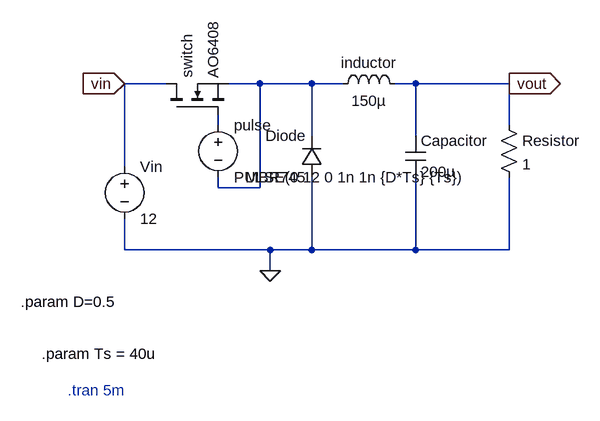
[diagram p0: schematic buck_converter.asc]
buck_converter.asc, the LTspice schematic file:
Version 4.1
SHEET 1 880 680
WIRE 176 -32 112 -32
WIRE 320 -32 272 -32
WIRE 400 -32 320 -32
WIRE 448 -32 400 -32
WIRE 560 -32 528 -32
WIRE 704 -32 560 -32
WIRE 256 32 256 16
WIRE 704 32 704 -32
WIRE 400 48 400 -32
WIRE 560 48 560 -32
WIRE 112 96 112 -32
WIRE 256 128 256 112
WIRE 320 128 320 -32
WIRE 320 128 256 128
WIRE 112 224 112 176
WIRE 336 224 112 224
WIRE 400 224 400 112
WIRE 400 224 336 224
WIRE 560 224 560 112
WIRE 560 224 400 224
WIRE 704 224 704 112
WIRE 704 224 560 224
WIRE 336 256 336 224
FLAG 336 256 0
FLAG 112 -32 vin
IOPIN 112 -32 In
FLAG 704 -32 vout
IOPIN 704 -32 Out
SYMBOL voltage 112 80 R0
WINDOW 123 0 0 Left 0
WINDOW 39 0 0 Left 0
SYMATTR InstName Vin
SYMATTR Value 12
SYMBOL nmos 176 16 R270
SYMATTR InstName switch
SYMATTR Value AO6408
SYMBOL cap 544 48 R0
SYMATTR InstName Capacitor
SYMATTR Value 200µ
SYMATTR SpiceLine Rser=1m
SYMBOL res 688 16 R0
SYMATTR InstName Resistor
SYMATTR Value 1
SYMBOL voltage 256 16 R0
WINDOW 123 0 0 Left 0
WINDOW 39 0 0 Left 0
SYMATTR InstName pulse
SYMATTR Value PULSE(0 12 0 1n 1n {D*Ts} {Ts})
SYMBOL diode 416 112 R180
WINDOW 0 24 64 Left 2
WINDOW 3 24 0 Left 2
SYMATTR InstName Diode
SYMATTR Value MBR745
SYMBOL ind 432 -16 R270
WINDOW 0 32 56 VTop 2
WINDOW 3 5 56 VBottom 2
SYMATTR InstName inductor
SYMATTR Value 150µ
SYMATTR SpiceLine Rser=20m
TEXT -48 304 Left 2 !.param D=0.5
TEXT -16 384 Left 2 !.param Ts = 40u
TEXT 24 440 Left 2 ;.tran 5m

The netlist it stands for:
* buck_converter.asc
Vin vin 0 12
M§switch vin N002 N001 N001 AO6408
Capacitor vout 0 200µ Rser=1m
Resistor vout 0 1
V§pulse N002 N001 PULSE(0 12 0 1n 1n {D*Ts} {Ts})
Diode 0 N001 MBR745
L§inductor N001 vout 150µ Rser=20m
.model D D
.lib standard.dio
.model NMOS NMOS
.model PMOS PMOS
.lib standard.mos
.param D=0.5
.param Ts = 40u
* .tran 5m
.backanno
.end